# EAGLE design ua741_transistors_version (EAGLE 9.6.2)
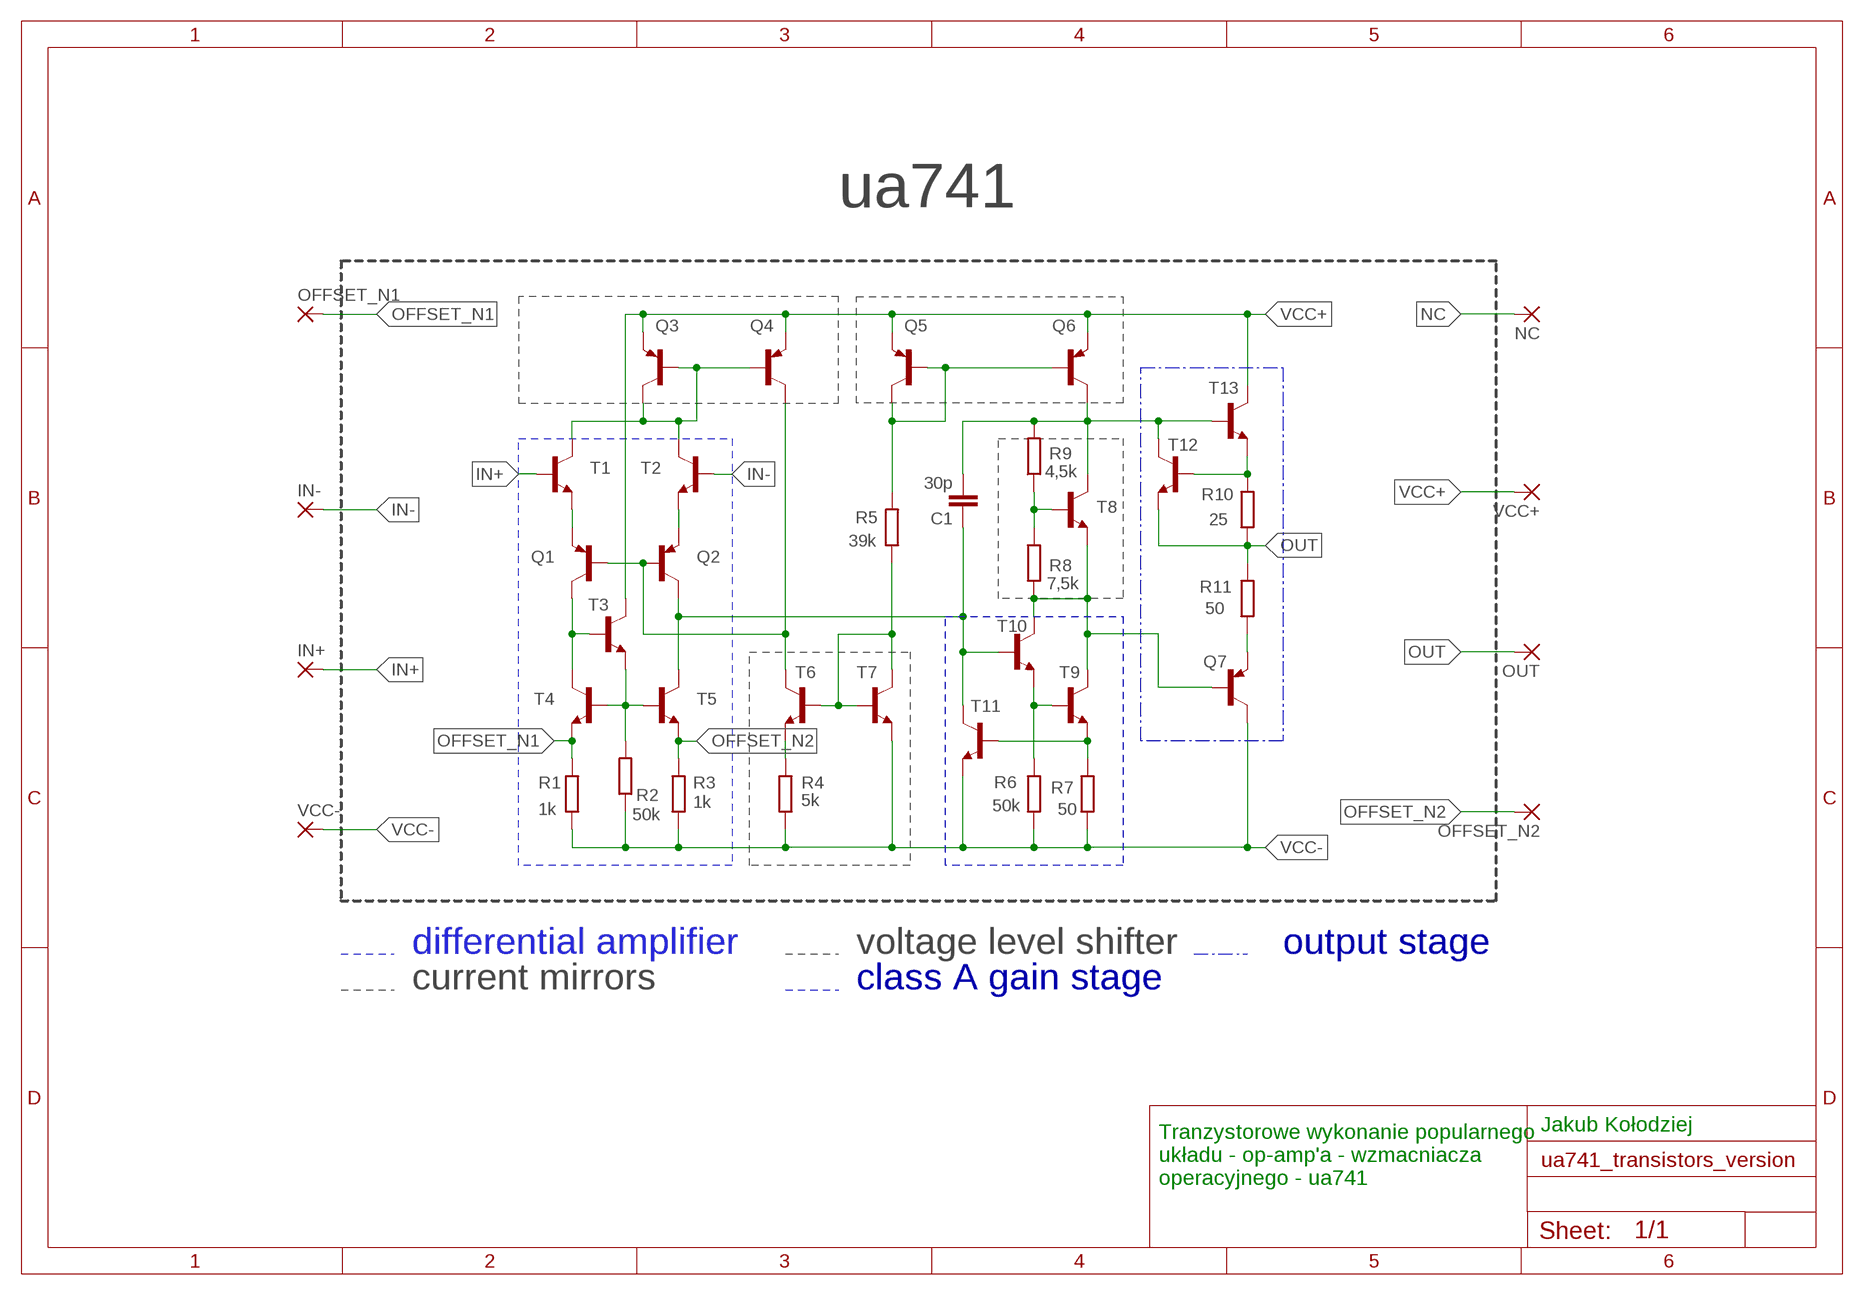
[diagram p0: schematic, sheet 1]

## Parts
C1  30p  C-EU025-025X050  [C025-025X050]
IN+  3,81/1,4  [3,81/1,4]
IN-  3,81/1,4  [3,81/1,4]
NC  3,81/1,4  [3,81/1,4]
OFFSET_N1  3,81/1,4  [3,81/1,4]
OFFSET_N2  3,81/1,4  [3,81/1,4]
OUT  3,81/1,4  [3,81/1,4]
Q1  BC557  [TO92]
Q2  BC557  [TO92]
Q3  BC557  [TO92]
Q4  BC557  [TO92]
Q5  BC557  [TO92]
Q6  BC557  [TO92]
Q7  BC557  [TO92]
R1  1k  R-EU_0207/7  [0207/7]
R2  50k  R-EU_0207/7  [0207/7]
R3  1k  R-EU_0207/7  [0207/7]
R4  5k  R-EU_0207/7  [0207/7]
R5  39k  R-EU_0207/7  [0207/7]
R6  50k  R-EU_0207/7  [0207/7]
R7  50  R-EU_0207/7  [0207/7]
R8  7,5k  R-EU_0207/7  [0207/7]
R9  4,5k  R-EU_0207/7  [0207/7]
R10  25  R-EU_0207/7  [0207/7]
R11  50  R-EU_0207/7  [0207/7]
T1  BC547  [TO92]
T2  BC547  [TO92]
T3  BC547  [TO92]
T4  BC547  [TO92]
T5  BC547  [TO92]
T6  BC547  [TO92]
T7  BC547  [TO92]
T8  BC547  [TO92]
T9  BC547  [TO92]
T10  BC547  [TO92]
T11  BC547  [TO92]
T12  BC547  [TO92]
T13  BC547  [TO92]
VCC+  3,81/1,4  [3,81/1,4]
VCC-  3,81/1,4  [3,81/1,4]

## Nets
IN+: IN+.1(P) T1.2(B)
IN-: IN-.1(P) T2.2(B)
N$2: Q1.2(B) Q2.2(B) Q4.3(C) T6.3(C)
N$4: Q1.1(E) T1.1(E)
N$5: Q2.1(E) T2.1(E)
N$6: Q1.3(C) T3.2(B) T4.3(C)
N$7: R2.2 T3.1(E) T4.2(B) T5.2(B)
N$9: C1.1 Q2.3(C) T5.3(C) T10.2(B) T11.3(C)
N$10: Q3.2(B) Q3.3(C) Q4.2(B) T1.3(C) T2.3(C)
N$12: R4.2 T6.1(E)
N$13: R5.1 T6.2(B) T7.2(B) T7.3(C)
N$14: R7.2 T9.1(E) T11.2(B)
N$15: R6.2 T9.2(B) T10.1(E)
N$16: Q7.2(B) R8.1 T8.1(E) T9.3(C) T10.3(C)
N$17: Q7.1(E) R11.1
N$19: Q5.2(B) Q5.3(C) Q6.2(B) R5.2
N$20: R10.2 T12.2(B) T13.1(E)
N$21: C1.2 Q6.3(C) R9.2 T8.3(C) T12.3(C) T13.2(B)
N$22: R8.2 R9.1 T8.2(B)
NC: NC.1(P)
OFFSET_N1: OFFSET_N1.1(P) R1.2 T4.1(E)
OFFSET_N2: OFFSET_N2.1(P) R3.2 T5.1(E)
OUT: OUT.1(P) R10.1 R11.2 T12.1(E)
VCC+: Q3.1(E) Q4.1(E) Q5.1(E) Q6.1(E) T3.3(C) T13.3(C) VCC+.1(P)
VCC-: Q7.3(C) R1.1 R2.1 R3.1 R4.1 R6.1 R7.1 T7.1(E) T11.1(E) VCC-.1(P)

## Buses
B$1
B$2
B$3
B$4

## Notes on the sheet
- ua741
- differential amplifier | voltage level shifter | output stage
- current mirrors | class A gain stage
- Jakub Kołodziej
- Tranzystorowe wykonanie popularnego
  układu - op-amp'a - wzmacniacza
  operacyjnego - ua741

## Library data of the parts
C1 = rcl:C-EU: CAPACITOR, European symbol; SPICEPREFIX: C
IN+ IN- NC OFFSET_N1 OFFSET_N2 OUT VCC+ VCC- = wirepad:3,81/1,4: THROUGH-HOLE PAD
Q1-Q7 = transistor-pnp:BC557: PNP Transistor
R1-R11 = resistor:R-EU_: RESISTOR, European symbol
T1-T13 = transistor:BC547: NPN TRANSISTOR

## Board
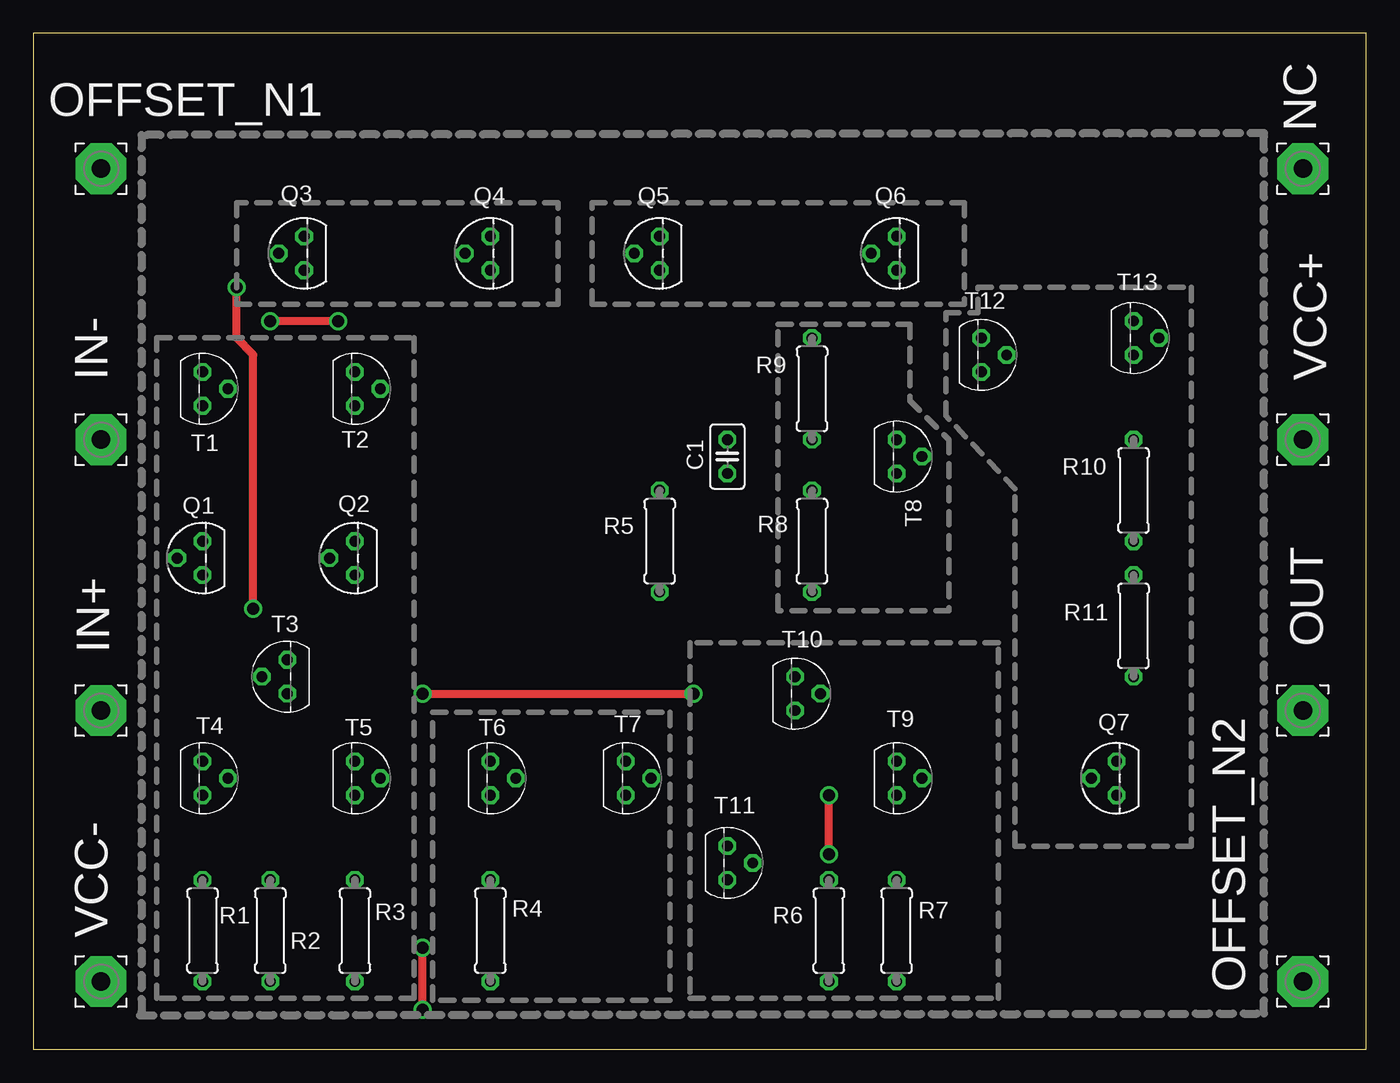
[diagram p1: board, top side]
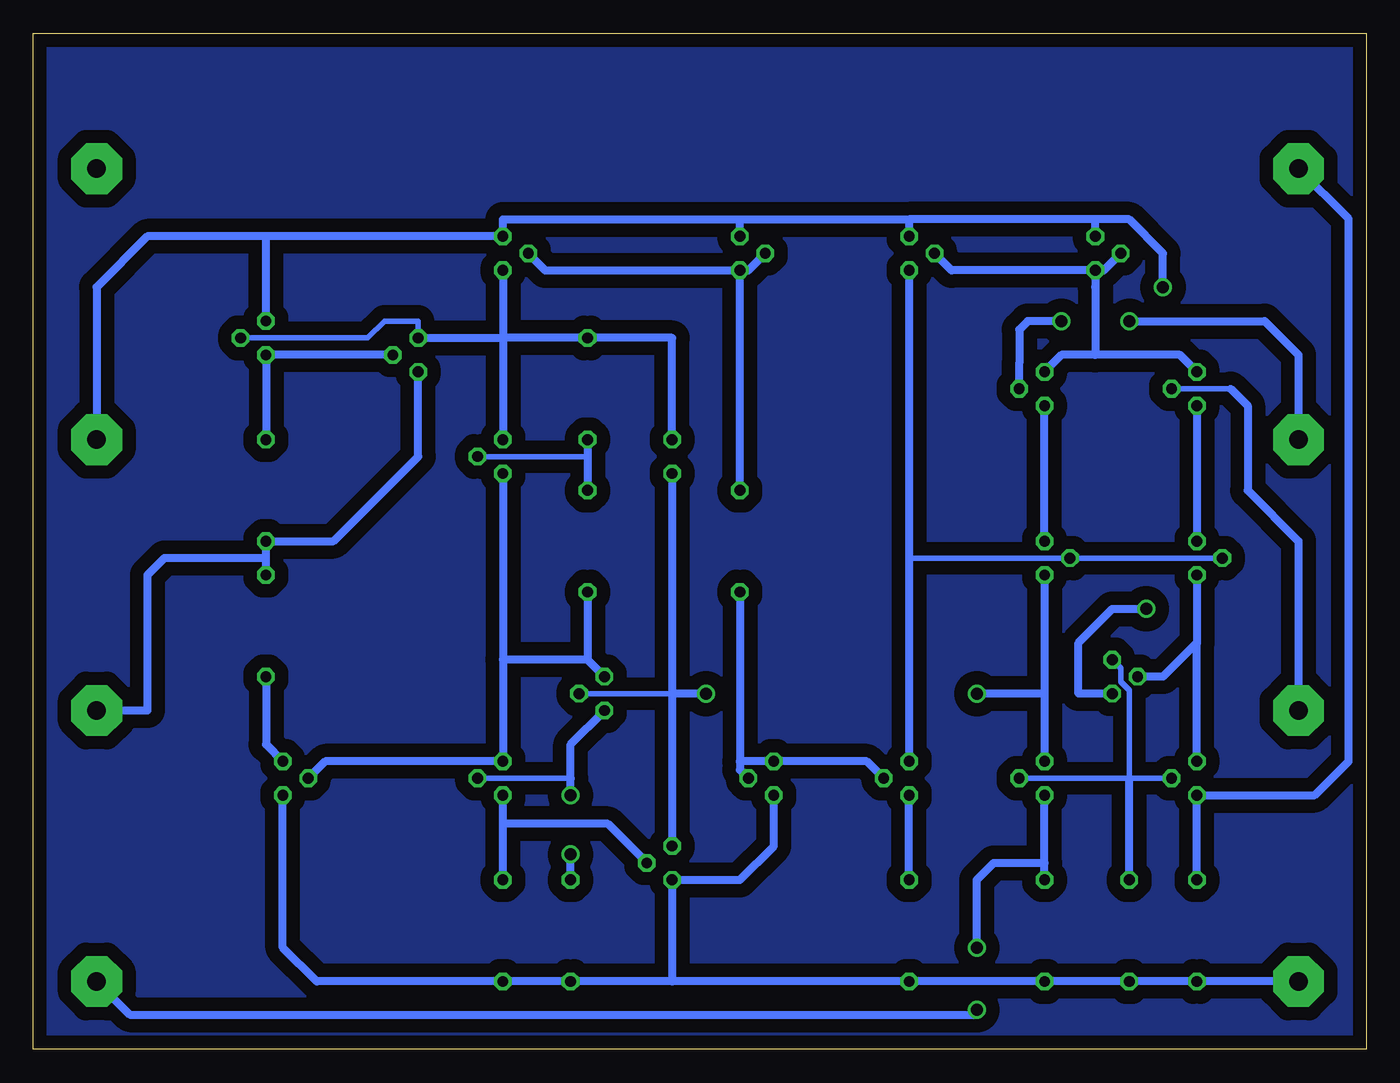
[diagram p2: board, bottom side, seen from below]

Size 100 x 76.19 mm. Coordinates in mm from the lower left corner, seen from the top.
Outline: 0,0 100,0 100,76.19 0,76.19 0,0
Copper layers (1*16): Top 0.035mm / dielectric 1.5mm / Bottom 0.035mm
Design rules "default": minimum track width 6mil, minimum drill 0.35mm, track to track 6mil, track to pad 6mil, pad to pad 6mil, via to via 6mil, smd to smd 6mil, copper to edge 40mil, drill to drill 6mil, minimum pad ring 10mil, minimum via ring 8mil, stop-mask expansion 4mil, vias tented up to drill 0mil, thermal gap 10mil

### Footprints (pad centres in the part's own frame; a part is rotated, then mirrored left to right if it is on the bottom)
C025-025X050 = drill 0.813 octagon: 1 -1.27,0; 2 1.27,0
3,81/1,4 = drill 1.397 pad 3.81 octagon: 1 0,0
TO92 = drill 0.813 octagon: 1 1.27,0; 2 0,1.905; 3 -1.27,0
0207/7 = drill 0.813 octagon: 1 -3.81,0; 2 3.81,0

### Placement (x,y rotation side)
C1  52.07,44.45 90 top
IN+  5.08,25.4 0 top
IN-  5.08,45.72 0 top
NC  95.25,66.04 0 top
OFFSET_N1  5.08,66.04 0 top
OFFSET_N2  95.25,5.08 0 top
OUT  95.25,25.4 0 top
Q1  12.7,36.83 90 top
Q2  24.13,36.83 90 top
Q3  20.32,59.69 90 top
Q4  34.29,59.69 90 top
Q5  46.99,59.69 90 top
Q6  64.77,59.69 90 top
Q7  81.28,20.32 90 top
R1  12.7,8.89 90 top
R2  17.78,8.89 90 top
R3  24.13,8.89 90 top
R4  34.29,8.89 90 top
R5  46.99,38.1 90 top
R6  59.69,8.89 90 top
R7  64.77,8.89 90 top
R8  58.42,38.1 90 top
R9  58.42,49.53 90 top
R10  82.55,41.91 90 top
R11  82.55,31.75 90 top
T1  12.7,49.53 270 top
T2  24.13,49.53 270 top
T3  19.05,27.94 90 top
T4  12.7,20.32 270 top
T5  24.13,20.32 270 top
T6  34.29,20.32 270 top
T7  44.45,20.32 270 top
T8  64.77,44.45 270 top
T9  64.77,20.32 270 top
T10  57.15,26.67 270 top
T11  52.07,13.97 270 top
T12  71.12,52.07 270 top
T13  82.55,53.34 270 top
VCC+  95.25,45.72 0 top
VCC-  5.08,5.08 0 top

### Tracks (layer width: path | path; a pad name or v marks a point on that pad's centre or on a via)
GND
  pour Bottom (isolate 1.016): 0,0 0,76.2 100.33,76.2 100.33,0
IN+
  Bottom 0.406: T1.2 10.16,49.53
  Bottom 0.61: 10.16,49.53 8.89,48.26 8.89,41.91 5.08,38.1 IN+.1
IN-  (via drill 0.9)
  Top 0.61: v22.86,54.61 v17.78,54.61
  Bottom 0.61: T2.2 26.04,50.8 26.04,51.44 26.04,53.98 25.4,54.61 v22.86,54.61 | v17.78,54.61 7.62,54.61 5.08,52.07 IN-.1
N$2
  Bottom 0.406: Q1.2 Q2.2 34.29,36.83
  Bottom 0.61: Q4.3 34.29,36.83 T6.3
N$4
  Bottom 0.61: T1.1 Q1.1
N$5
  Bottom 0.61: Q2.1 T2.1
N$6
  Bottom 0.61: Q1.3 12.7,30.48 | 12.7,30.48 15.24,27.94 T3.2 | T4.3 12.7,30.48
N$7
  Bottom 0.406: T3.1 18.41,28.57 18.41,27.56 17.78,26.92 17.78,20.32 | T4.2 17.78,20.32 | 17.78,20.32 T5.2
  Bottom 0.61: R2.2 17.78,20.32
N$9  (via drill 0.9)
  Top 0.61: v29.21,26.67 v49.53,26.67
  Bottom 0.406: T10.2 52.07,26.67
  Bottom 0.61: C1.1 52.07,26.67 | 52.07,26.67 T11.3 | Q2.3 24.13,26.67 | 24.13,26.67 T5.3 | 24.13,26.67 v29.21,26.67 | v49.53,26.67 52.07,26.67
N$10
  Bottom 0.61: T1.3 13.97,52.07 20.32,52.07 | 20.32,52.07 22.86,52.07 T2.3 | Q3.3 20.32,57.15 20.32,52.07 | Q3.3 19.68,58.42 Q3.2 | Q3.3 31.11,58.42 Q4.2
N$12
  Bottom 0.61: R4.2 T6.1
N$13
  Bottom 0.61: R5.1 46.99,21.59 | 46.99,21.59 46.99,20.95 T7.2 | T6.2 37.47,21.59 T7.3 46.99,21.59
N$14
  Bottom 0.61: R7.2 64.77,16.89 | 64.77,16.89 T9.1 | T11.2 56.9,16.89 64.77,16.89
N$15  (via drill 0.9)
  Top 0.61: v59.69,14.61 v59.69,19.05
  Bottom 0.406: T9.2 59.69,20.32
  Bottom 0.61: v59.69,19.05 59.69,20.32 59.69,22.86 T10.1 | R6.2 v59.69,14.61
N$16
  Bottom 0.61: Q7.2 78.11,21.59 T9.3 64.77,29.21 | T8.1 64.77,29.21 | R8.1 58.42,29.21 | T10.3 58.42,29.21 | 58.42,29.21 64.77,29.21
N$17
  Bottom 0.61: R11.1 82.55,22.86 Q7.1
N$19
  Bottom 0.61: Q6.2 61.59,58.42 Q5.3 | Q5.3 46.35,58.42 Q5.2 | R5.2 Q5.3
N$20
  Bottom 0.61: T12.2 T13.1 R10.2
N$21
  Bottom 0.406: T13.2 74.93,53.34 73.66,54.61 71.12,54.61 T12.3
  Bottom 0.61: Q6.3 64.77,53.34 | 64.77,53.34 T8.3 | T12.3 64.77,53.34 | 64.77,53.34 R9.2 52.07,53.34 C1.2
N$22
  Bottom 0.406: T8.2 58.42,44.45
  Bottom 0.61: R9.1 58.42,44.45 R8.2
OFFSET_N1
  Bottom 0.61: R1.2 T4.1 3.86,19.05 1.32,21.59 1.32,62.28 OFFSET_N1.1
OFFSET_N2  (via drill 0.9)
  Top 0.61: v29.21,2.96 v29.21,7.62
  Bottom 0.61: R3.2 24.13,13.97 | 24.13,13.97 T5.1 | OFFSET_N2.1 92.76,2.59 29.21,2.59 v29.21,2.96 | v29.21,7.62 29.21,12.7 27.94,13.97 24.13,13.97
OUT
  Bottom 0.61: R11.2 82.55,36.83 | 82.55,36.83 R10.1 77.47,38.1 71.12,44.45 T12.1 | 82.55,36.83 90.17,36.83 91.44,35.56 91.44,25.4 OUT.1
VCC+  (via drill 0.9)
  Top 0.61: v16.51,33.02 16.51,52.07 15.24,53.34 v15.24,57.15
  Bottom 0.61: 82.55,60.96 Q6.1 64.77,62.23 46.99,62.23 | 82.55,60.96 91.44,60.96 95.25,57.15 VCC+.1 | T13.3 82.55,60.96 | v16.51,33.02 19.05,33.02 21.59,30.48 21.59,26.67 T3.3 | v15.24,57.15 15.24,59.69 17.78,62.23 20.32,62.23 | 34.29,62.23 Q4.1 | 20.32,62.23 34.29,62.23 | Q3.1 20.32,62.23 | Q5.1 46.99,62.23 | 46.99,62.23 34.29,62.23
VCC-
  Bottom 0.61: 52.07,5.08 R4.1 R3.1 R2.1 R1.1 VCC-.1 | 52.07,5.08 R6.1 R7.1 78.74,5.08 81.28,7.62 Q7.3 | 52.07,5.08 T11.1 46.99,12.7 44.45,15.24 T7.1

### Text on the board
tDocu: ua741